# EAGLE design touch-sensorboardW (EAGLE 5.11)
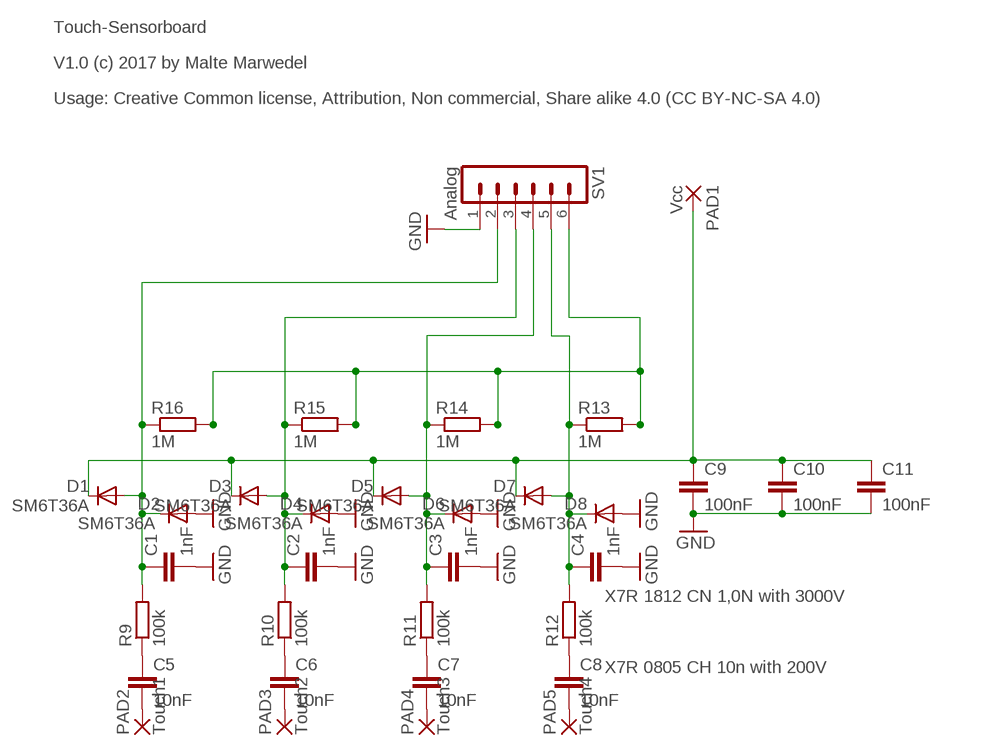
[diagram p0: schematic, sheet 1]

## Parts
C1  1nF  C-EUC1812  [C1812]
C2  1nF  C-EUC1812  [C1812]
C3  1nF  C-EUC1812  [C1812]
C4  1nF  C-EUC1812  [C1812]
C5  10nF  C-EUC0805  [C0805]
C6  10nF  C-EUC0805  [C0805]
C7  10nF  C-EUC0805  [C0805]
C8  10nF  C-EUC0805  [C0805]
C9  100nF  C-EUC0805  [C0805]
C10  100nF  C-EUC0805  [C0805]
C11  100nF  C-EUC0805  [C0805]
D1  SM6T36A  DIODE-DO214AA  [DO214AA]
D2  SM6T36A  DIODE-DO214AA  [DO214AA]
D3  SM6T36A  DIODE-DO214AA  [DO214AA]
D4  SM6T36A  DIODE-DO214AA  [DO214AA]
D5  SM6T36A  DIODE-DO214AA  [DO214AA]
D6  SM6T36A  DIODE-DO214AA  [DO214AA]
D7  SM6T36A  DIODE-DO214AA  [DO214AA]
D8  SM6T36A  DIODE-DO214AA  [DO214AA]
PAD1  Vcc  1,6/0,8  [1,6/0,8]
PAD2  Touch1  WIREPAD7/4,1  [7O4,1]
PAD3  Touch2  WIREPAD7/4,1  [7O4,1]
PAD4  Touch3  WIREPAD7/4,1  [7O4,1]
PAD5  Touch4  WIREPAD7/4,1  [7O4,1]
R9  100k  R-EU_M1206  [M1206]
R10  100k  R-EU_M1206  [M1206]
R11  100k  R-EU_M1206  [M1206]
R12  100k  R-EU_M1206  [M1206]
R13  1M  R-EU_R0805  [R0805]
R14  1M  R-EU_R0805  [R0805]
R15  1M  R-EU_R0805  [R0805]
R16  1M  R-EU_R0805  [R0805]
SV1  Analog  MA06-1  [MA06-1]

## Nets
GND: C1.2 C2.2 C3.2 C4.2 C9.2 C10.2 C11.2 D2.A D4.A D6.A D8.A SV1.1
N$1: C5.1 R9.1
N$2: C5.2 PAD2.1(P)
N$3: C6.1 R10.1
N$4: C6.2 PAD3.1(P)
N$5: C1.1 D1.A D2.C R9.2 R16.1 SV1.2
N$6: C3.1 D5.A D6.C R11.2 R14.1 SV1.4
N$7: C4.1 D7.A D8.C R12.2 R13.1 SV1.5
N$8: C2.1 D3.A D4.C R10.2 R15.1 SV1.3
N$9: R13.2 R14.2 R15.2 R16.2 SV1.6
N$10: C9.1 C10.1 C11.1 D1.C D3.C D5.C D7.C PAD1.1(P)
N$11: C7.2 PAD4.1(P)
N$12: C7.1 R11.1
N$13: C8.2 PAD5.1(P)
N$14: C8.1 R12.1

## Notes on the sheet
- Touch-Sensorboard
- V1.0 (c) 2017 by Malte Marwedel
- Usage: Creative Common license, Attribution, Non commercial, Share alike 4.0 (CC BY-NC-SA 4.0)
- X7R 1812 CN 1,0N with 3000V
- X7R 0805 CH 10n with 200V

## Library data of the parts
C1-C11 = rcl:C-EU: CAPACITOR, European symbol
D1-D8 = diode:DIODE-: DIODE
PAD1 = wirepad:1,6/0,8: THROUGH-HOLE PAD
PAD2-PAD5 = maltes2_lib:WIREPAD: Wire PAD connect wire on PCB
R9-R16 = rcl:R-EU_: RESISTOR, European symbol
SV1 = con-lstb:MA06-1: PIN HEADER; OC_FARNELL: unknown; OC_NEWARK: unknown

## Board
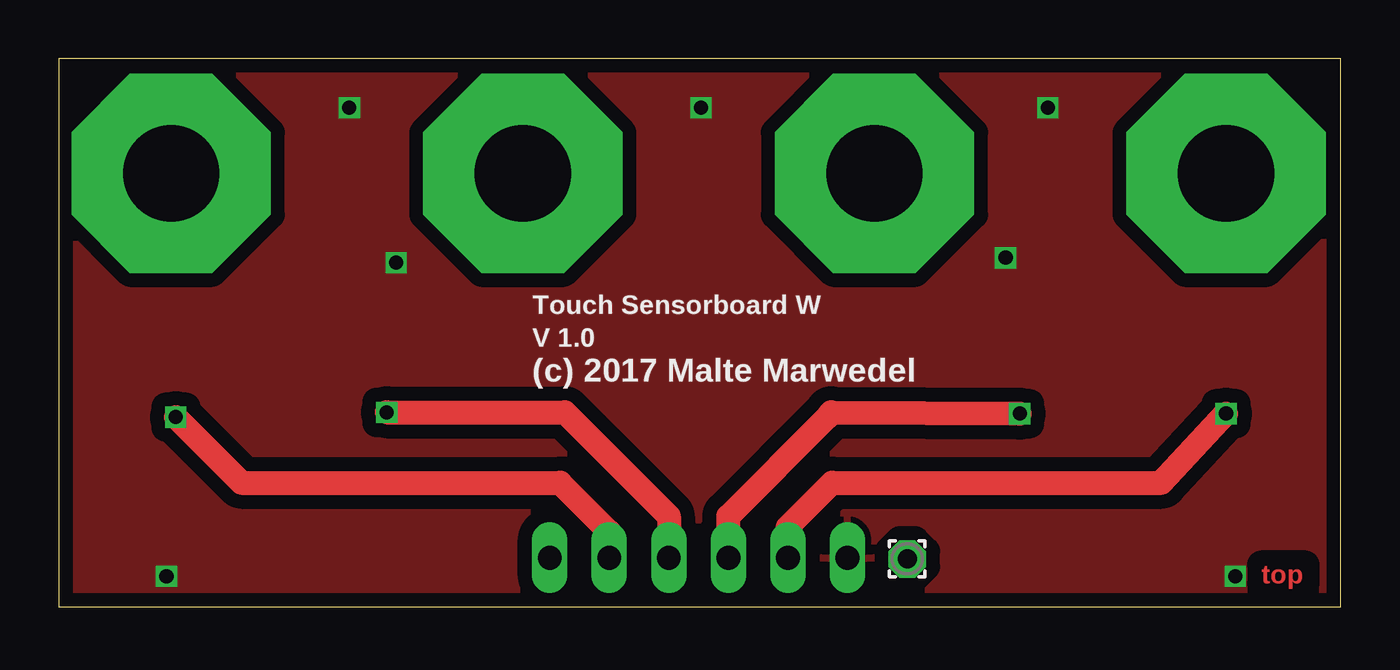
[diagram p1: board, top side]
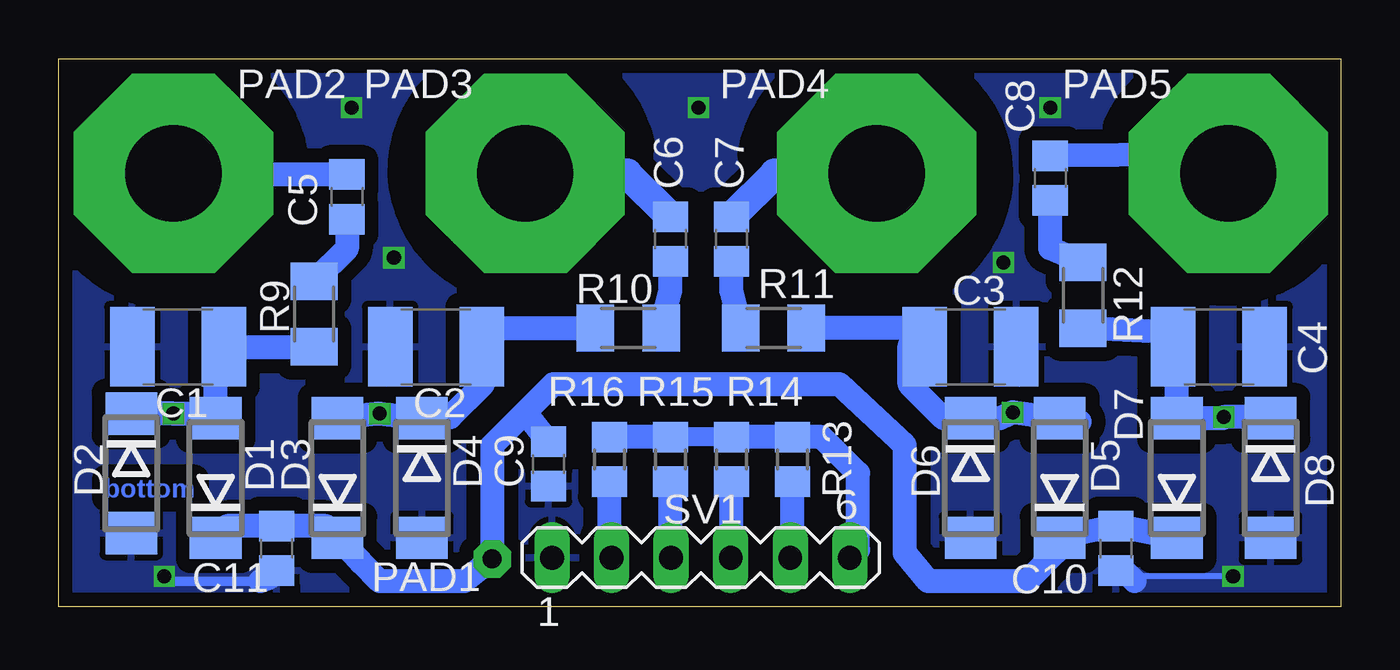
[diagram p2: board, bottom side, seen from below]

Size 54.7 x 23.4 mm. Coordinates in mm from the lower left corner, seen from the top.
Outline: 0,0 54.7,0 54.7,23.4 0,23.4 0,0
Copper layers (1*16): Top 0.035mm / dielectric 1.6mm / Bottom 0.035mm
Design rules "Elecrow_2-layer_PCB_eagle_rule": minimum track width 6mil, minimum drill 12mil, track to track 6mil, track to pad 6mil, pad to pad 6mil, via to via 8mil, smd to smd 0mil, copper to edge 20mil, drill to drill 10mil, minimum pad ring 6mil, minimum via ring 6mil, stop-mask expansion 0mil, vias tented up to drill 100mil, thermal gap 10mil
bRestrict: 4 lines

### Footprints (pad centres in the part's own frame; a part is rotated, then mirrored left to right if it is on the bottom)
C1812 = smd 1.9 x 3.4: 1 -1.95,0; 2 1.95,0
C0805 = smd 1.3 x 1.5: 1 -0.95,0; 2 0.95,0
DO214AA = smd 1.8 x 2.2: A 2.55,0; C -2.55,0
1,6/0,8 = drill 0.813 pad 1.6 octagon: 1 0,0
7O4,1 = drill 4.1 pad 8.5 octagon: 1 0,0
M1206 = smd 1.6 x 2: 1 -1.4,0; 2 1.4,0
R0805 = smd 1.3 x 1.5: 1 -0.95,0; 2 0.95,0
MA06-1 = drill 1.016 long: 1 -6.35,0; 2 -3.81,0; 3 -1.27,0; 4 1.27,0; 5 3.81,0; 6 6.35,0

### Placement (x,y rotation side)
C1  49.6,11.1 180 bottom
C2  38.6,11.1 180 bottom
C3  15.8,11.1 0 bottom
C4  5.2,11.1 0 bottom
C5  42.4,17.5 90 bottom
C6  28.6,15.7 90 bottom
C7  26,15.7 90 bottom
C8  12.4,18.3 90 bottom
C9  33.8,6.1 270 bottom
C10  9.6,2.5 270 bottom
C11  45.4,2.5 270 bottom
D1  48,5.5 90 bottom
D2  51.6,5.7 270 bottom
D3  42.8,5.5 90 bottom
D4  39.2,5.5 270 bottom
D5  12,5.5 90 bottom
D6  15.8,5.5 270 bottom
D7  7,5.5 90 bottom
D8  3,5.5 270 bottom
PAD1  36.2,2.05 0 top
PAD2  49.8,18.5 0 top
PAD3  34.8,18.5 0 top
PAD4  19.8,18.5 0 top
PAD5  4.8,18.5 0 top
R9  43.8,12.5 270 bottom
R10  30.4,11.9 180 bottom
R11  24.2,11.9 0 bottom
R12  11,13.3 270 bottom
R13  23.4,6.3 90 bottom
R14  26,6.3 90 bottom
R15  28.6,6.3 90 bottom
R16  31.2,6.3 90 bottom
SV1  27.3,2.1 0 bottom

### Tracks (layer width: path | path; a pad name or v marks a point on that pad's centre or on a via)
GND  (via drill 0.6)
  Bottom 0.254: v4.6,1.3 8.4,1.3 8.8,1.1 | C11.2 45.65,1.3
  Bottom 0.406: 46.1,1.1 50,1.1 v50.2,1.3
  Bottom 1.016: C10.2 9.15,1.45 8.8,1.1 | 45.65,1.3 45.8,1.2 46.1,1.1
  other vias: 12.4,21.3 27.4,21.3 42.2,21.3 14.4,14.7 40.4,14.9
  pour Bottom (isolate 0.6): 0,23.4 54.8,23.4 54.8,0 0,0
  pour Top (isolate 0.6): 0,23.4 54.8,23.4 54.8,0 0,0
N$1
  Bottom 1.016: C5.1 42.4,15.3 R9.1
N$2
  Bottom 1.016: C5.2 49.75,18.45 PAD2.1
N$3
  Bottom 1.016: C6.1 28.6,13.5 R10.1
N$4
  Bottom 1.27: C6.2 30.45,18.5 PAD3.1
N$5  (via drill 0.6)
  Top 1.016: SV1.2 31.11,3.41 33,5.3 47.05,5.3 v49.8,8.25
  Bottom 1.016: R9.2 C1.1 48,10.75 D1.A 47.8,8.25 v49.8,8.25 D2.C | R16.1 31.2,2.19 SV1.2
N$6  (via drill 0.6)
  Top 1.016: SV1.4 26.03,3.87 21.6,8.3 v14,8.3
  Bottom 1.016: R11.2 17.75,11.9 C3.1 18.4,11.15 18.4,9.5 16.95,8.05 D6.C 14.55,8.05 v14,8.3 11.15,7.9 D5.A | R14.1 26,2.13 SV1.4
N$7  (via drill 0.6)
  Top 1.016: SV1.5 23.49,3.21 21.4,5.3 7.8,5.3 v5,8.1
  Bottom 1.016: R12.2 7.2,11.7 7.4,11.7 C4.1 7,11.55 D7.A 5.05,8.05 v5,8.1 3.25,8.1 D8.C | R13.1 23.4,2.19 SV1.5
N$8  (via drill 0.6)
  Top 1.016: SV1.3 28.57,3.87 32.8,8.1 32.95,8.3 v41,8.25
  Bottom 1.016: D3.A v41,8.25 D4.C 39.75,8.1 38,8.1 36.6,9.5 36.6,11.05 C2.1 36.4,11.35 36.4,11.9 R10.2 | R15.1 28.6,2.13 SV1.3
N$9
  Bottom 0.813: R14.2 R15.2
  Bottom 1.016: R14.2 R13.2 22.15,7.25 20.6,5.7 20.6,2.45 SV1.6 | R15.2 R16.2
N$10
  Bottom 1.016: 34.8,8.3 36.2,6.9 PAD1.1 37.4,1.1 41,1.1 41.8,1.9 D3.C 43.3,3.45 C11.1 47.5,3.45 D1.C | 34.8,8.3 C9.1 | 34.8,8.3 33.6,9.5 21.4,9.5 18.6,6.9 18.6,2.3 17.6,1.1 13.4,1.1 12.15,2.35 D5.C C10.1 D7.C
N$11
  Bottom 1.27: C7.2 24.15,18.5 PAD4.1
N$12
  Bottom 1.016: C7.1 26,13.5 R11.1
N$13
  Bottom 1.016: PAD5.1 6.55,19.3 C8.2
N$14
  Bottom 1.016: C8.1 12.4,15.3 R12.1

### Text on the board
Top: top
Bottom: bottom
_tsilk: Touch Sensorboard W | V 1.0 | (c) 2017 Malte Marwedel